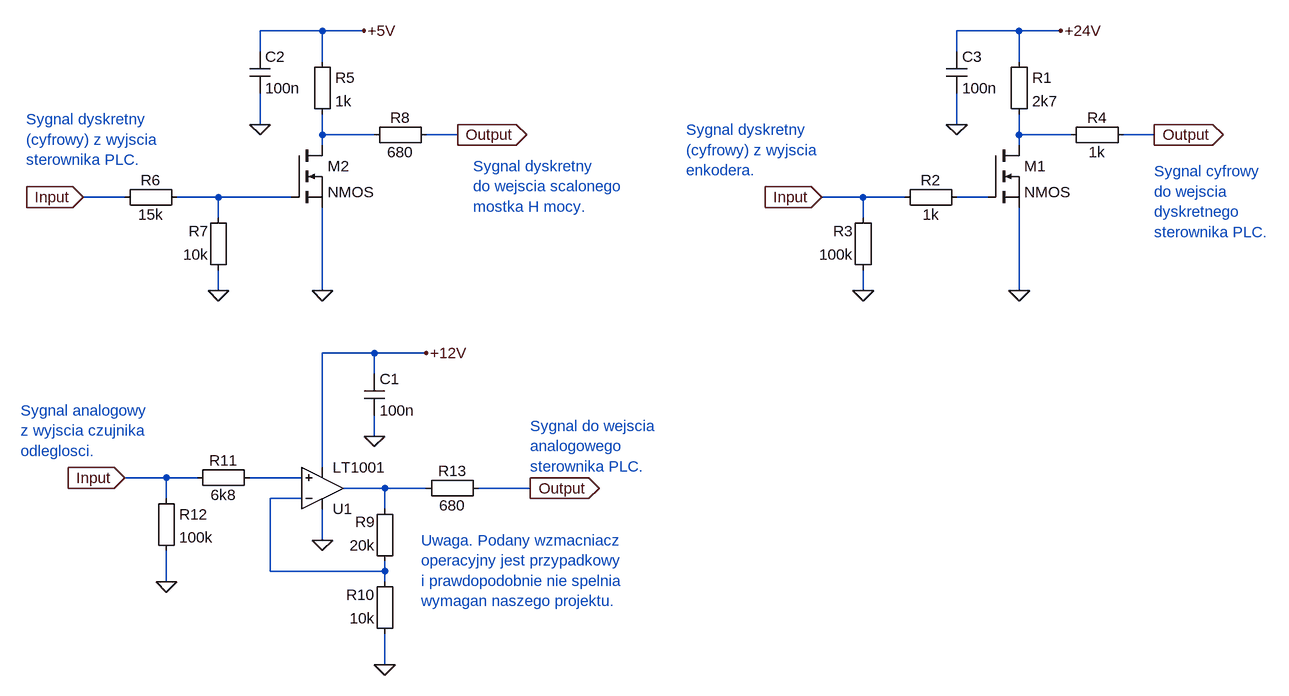
[diagram p0: schematic Draft2.asc]
Draft2.asc, the LTspice schematic file:
Version 4
SHEET 1 880 948
WIRE -688 -48 -784 -48
WIRE -624 -48 -688 -48
WIRE 384 -48 288 -48
WIRE 448 -48 384 -48
WIRE -784 -16 -784 -48
WIRE 288 -16 288 -48
WIRE -688 0 -688 -48
WIRE 384 0 384 -48
WIRE -784 96 -784 48
WIRE 288 96 288 48
WIRE -688 112 -688 80
WIRE -608 112 -688 112
WIRE -480 112 -528 112
WIRE 384 112 384 80
WIRE 464 112 384 112
WIRE 592 112 544 112
WIRE -688 128 -688 112
WIRE 384 128 384 112
WIRE -992 208 -1056 208
WIRE -848 208 -912 208
WIRE -736 208 -848 208
WIRE 144 208 80 208
WIRE 208 208 144 208
WIRE 336 208 288 208
WIRE -848 240 -848 208
WIRE 144 240 144 208
WIRE -848 352 -848 320
WIRE -688 352 -688 224
WIRE 144 352 144 320
WIRE 384 352 384 224
WIRE -608 448 -688 448
WIRE -528 448 -608 448
WIRE -608 480 -608 448
WIRE -608 576 -608 544
WIRE -688 624 -688 448
WIRE -928 640 -992 640
WIRE -880 640 -928 640
WIRE -720 640 -800 640
WIRE -592 656 -656 656
WIRE -528 656 -592 656
WIRE -368 656 -448 656
WIRE -928 672 -928 640
WIRE -720 672 -768 672
WIRE -592 688 -592 656
WIRE -688 736 -688 688
WIRE -768 784 -768 672
WIRE -592 784 -592 768
WIRE -592 784 -768 784
WIRE -928 800 -928 752
WIRE -592 800 -592 784
WIRE -592 928 -592 880
FLAG 144 352 0
FLAG 384 352 0
FLAG 448 -48 +24V
FLAG 592 112 Output
IOPIN 592 112 Out
FLAG 80 208 Input
IOPIN 80 208 In
FLAG -848 352 0
FLAG -688 352 0
FLAG -624 -48 +5V
FLAG -480 112 Output
IOPIN -480 112 Out
FLAG -1056 208 Input
IOPIN -1056 208 In
FLAG -688 736 0
FLAG -528 448 +12V
FLAG -368 656 Output
IOPIN -368 656 Out
FLAG -992 640 Input
IOPIN -992 640 In
FLAG -928 800 0
FLAG -592 928 0
FLAG -608 576 0
FLAG -784 96 0
FLAG 288 96 0
SYMBOL nmos 336 128 R0
SYMATTR InstName M1
SYMBOL Misc\\EuropeanResistor 368 -16 R0
SYMATTR InstName R1
SYMATTR Value 2k7
SYMBOL Misc\\EuropeanResistor 304 192 R90
WINDOW 0 5 56 VBottom 2
WINDOW 3 27 56 VTop 2
SYMATTR InstName R2
SYMATTR Value 1k
SYMBOL Misc\\EuropeanResistor 160 336 R180
WINDOW 0 31 76 Left 2
WINDOW 3 31 40 Left 2
SYMATTR InstName R3
SYMATTR Value 100k
SYMBOL Misc\\EuropeanResistor 560 96 R90
WINDOW 0 5 56 VBottom 2
WINDOW 3 27 56 VTop 2
SYMATTR InstName R4
SYMATTR Value 1k
SYMBOL nmos -736 128 R0
SYMATTR InstName M2
SYMBOL Misc\\EuropeanResistor -704 -16 R0
SYMATTR InstName R5
SYMATTR Value 1k
SYMBOL Misc\\EuropeanResistor -832 336 R180
WINDOW 0 31 76 Left 2
WINDOW 3 31 40 Left 2
SYMATTR InstName R7
SYMATTR Value 10k
SYMBOL Misc\\EuropeanResistor -512 96 R90
WINDOW 0 5 56 VBottom 2
WINDOW 3 27 56 VTop 2
SYMATTR InstName R8
SYMATTR Value 680
SYMBOL Misc\\EuropeanResistor -1008 224 R270
WINDOW 0 27 56 VTop 2
WINDOW 3 5 56 VBottom 2
SYMATTR InstName R6
SYMATTR Value 15k
SYMBOL Opamps\\LT1001 -688 720 M180
SYMATTR InstName U1
SYMBOL Misc\\EuropeanResistor -576 784 R180
WINDOW 0 31 76 Left 2
WINDOW 3 31 40 Left 2
SYMATTR InstName R9
SYMATTR Value 20k
SYMBOL Misc\\EuropeanResistor -576 896 R180
WINDOW 0 31 76 Left 2
WINDOW 3 31 40 Left 2
SYMATTR InstName R10
SYMATTR Value 10k
SYMBOL Misc\\EuropeanResistor -896 656 R270
WINDOW 0 27 56 VTop 2
WINDOW 3 5 56 VBottom 2
SYMATTR InstName R11
SYMATTR Value 6k8
SYMBOL Misc\\EuropeanResistor -944 656 R0
SYMATTR InstName R12
SYMATTR Value 100k
SYMBOL Misc\\EuropeanResistor -432 640 R90
WINDOW 0 5 56 VBottom 2
WINDOW 3 27 56 VTop 2
SYMATTR InstName R13
SYMATTR Value 680
SYMBOL cap -624 480 R0
SYMATTR InstName C1
SYMATTR Value 100n
SYMBOL cap -800 -16 R0
SYMATTR InstName C2
SYMATTR Value 100n
SYMBOL cap 272 -16 R0
SYMATTR InstName C3
SYMATTR Value 100n
TEXT -1144 88 Left 2 ;Sygnal dyskretny\n(cyfrowy) z wyjscia\nsterownika PLC.
TEXT -128 104 Left 2 ;Sygnal dyskretny\n(cyfrowy) z wyjscia\nenkodera.
TEXT -456 160 Left 2 ;Sygnal dyskretny\ndo wejscia scalonego\nmostka H mocy.
TEXT 592 168 Left 2 ;Sygnal cyfrowy\ndo wejscia\ndyskretnego\nsterownika PLC.
TEXT -1152 536 Left 2 ;Sygnal analogowy\nz wyjscia czujnika\nodleglosci.
TEXT -368 560 Left 2 ;Sygnal do wejscia\nanalogowego\nsterownika PLC.
TEXT -536 736 Left 2 ;Uwaga. Podany wzmacniacz\noperacyjny jest przypadkowy\ni prawdopodobnie nie spelnia\nwymagan naszego projektu.

The netlist it stands for:
* Draft2.asc
M1 N002 N004 0 0 NMOS
R1 +24V N002 2k7
R2 N004 Input 1k
R3 0 Input 100k
R4 Output N002 1k
M2 N001 N003 0 0 NMOS
R5 +5V N001 1k
R7 0 N003 10k
R8 Output N001 680
R6 Input N003 15k
XU1 N005 N007 0 +12V N006 LT1001  ; pins In+ In- V+ V- OUT
R9 N007 N006 20k
R10 0 N007 10k
R11 Input N005 6k8
R12 Input 0 100k
R13 Output N006 680
C1 +12V 0 100n
C2 +5V 0 100n
C3 +24V 0 100n
.model NMOS NMOS
.model PMOS PMOS
.lib standard.mos
* Sygnal dyskretny
* (cyfrowy) z wyjscia
* sterownika PLC.
* Sygnal dyskretny
* (cyfrowy) z wyjscia
* enkodera.
* Sygnal dyskretny
* do wejscia scalonego
* mostka H mocy.
* Sygnal cyfrowy
* do wejscia
* dyskretnego
* sterownika PLC.
* Sygnal analogowy
* z wyjscia czujnika
* odleglosci.
* Sygnal do wejscia
* analogowego
* sterownika PLC.
* Uwaga. Podany wzmacniacz
* operacyjny jest przypadkowy
* i prawdopodobnie nie spelnia
* wymagan naszego projektu.
.lib LTC.lib
.backanno
.end